# EAGLE schematic Nadajnik (EAGLE 9.0.1)
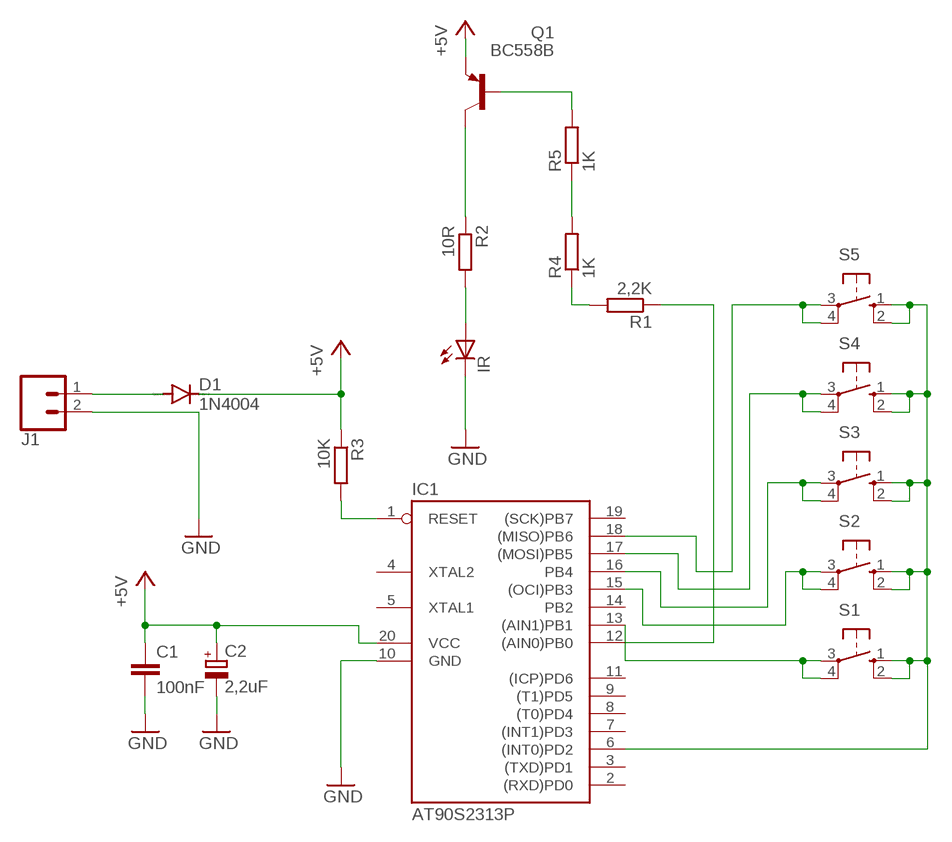
[diagram p0: schematic, sheet 1]

## Parts
C1  100nF  C-EU025-024X044  [C025-024X044]
C2  2,2uF  CPOL-EU140CLH-1010  [140CLH-1010]
D1  1N4004  [DO41-10]
IC1  AT90S2313P  [DIL20]
IR  LED5MM  [LED5MM]
J1  CONN_02  [1X02]
Q1  BC558B  [TO92-EBC]
R1  2,2K  R-EU_0207/10  [0207/10]
R2  10R  R-EU_0207/10  [0207/10]
R3  10K  R-EU_0207/10  [0207/10]
R4  1K  R-EU_0207/10  [0207/10]
R5  1K  R-EU_0207/10  [0207/10]
S1  10-XX  [B3F-10XX]
S2  10-XX  [B3F-10XX]
S3  10-XX  [B3F-10XX]
S4  10-XX  [B3F-10XX]
S5  10-XX  [B3F-10XX]

## Nets
+5V: C1.1 C2.+ D1.C IC1.20(VCC) Q1.E R3.1
GND: C1.2 C2.- IC1.10(GND) IR.K(C) J1.2
N$1: IC1.12((AIN0)PB0) S1.3(P) S1.4(P1)
N$2: IC1.15((OCI)PB3) S2.3(P) S2.4(P1)
N$3: IC1.16(PB4) S3.3(P) S3.4(P1)
N$4: IC1.17((MOSI)PB5) S4.3(P) S4.4(P1)
N$5: IC1.18((MISO)PB6) S5.3(P) S5.4(P1)
N$6: R1.2 R4.1
N$7: IC1.13((AIN1)PB1) R1.1
N$8: Q1.C R2.1
N$9: R4.2 R5.1
N$10: IR.A R2.2
N$11: IC1.6((INT0)PD2) S1.1(S) S1.2(S1) S2.1(S) S2.2(S1) S3.1(S) S3.2(S1) S4.1(S) S4.2(S1) S5.1(S) S5.2(S1)
N$13: Q1.B R5.2
N$14: D1.A J1.1
N$15: IC1.1(RESET) R3.2
Unconnected: IC1.2((RXD)PD0) IC1.3((TXD)PD1) IC1.4(XTAL2) IC1.5(XTAL1) IC1.7((INT1)PD3) IC1.8((T0)PD4) IC1.9((T1)PD5) IC1.11((ICP)PD6) IC1.14(PB2) IC1.19((SCK)PB7)

## Library data of the parts
C1 = resistor:C-EU: CAPACITOR, European symbol
C2 = resistor:CPOL-EU: POLARIZED CAPACITOR, European symbol
D1 = diode:1N4004: DIODE general purpose rectifier, 1 A
IC1 = avr-4:AT90S2313: MICROCONTROLLER 2 Kbytes FLASH 128 bytes SRAM 128 bytes EEPROM UART
IR = led:LED: LED OSRAM: - CHIPLED LG R971, LG N971, LY N971, LG Q971, LY Q971, LO R971, LY R971 LH N974, LH R974 LS Q976, LO Q976, LY Q976 LO Q996 - Hyper CHIPLED LW Q18S LB Q993, LB Q99A, LB R99A - SideLED LS A670, LO A670, LY A670, LG A670, LP A670 LB A673, LV A673, LT A673, LW A673 LH A674 LY A675 LS A676, LA A676, LO A676, LY A676, LW A676 LS A679, LY A679, LG A679 - Hyper Micro SIDELED® LS Y876, LA Y876, LO Y876, LY Y876 LT Y87S - SmartLED LW L88C, LW L88S LB L89C, LB L89S, LG L890 LS L89K, LO L89K, LY L89K LS L896, LA L896, LO L896, LY L896 - TOPLED LS T670, LO T670, LY T670, LG T670, LP T670 LSG T670, LSP T670, LSY T670, LOP T670, LYG T670 LG T671, LOG T671, LSG T671 LB T673, LV T673, LT T673, LW T673 LH T674 LS T676, LA T676, LO T676, LY T676, LB T676, LH T676, LSB T676, LW T676 LB T67C, LV T67C, LT T67C, LS T67K, LO T67K, LY T67K, LW E67C LS E67B, LA E67B, LO E67B, LY E67B, LB E67C, LV E67C, LT E67C LW T67C LS T679, LY T679, LG T679 LS T770, LO T770, LY T770, LG T770, LP T770 LB T773, LV T773, LT T773, LW T773 LH T774 LS E675, LA E675, LY E675, LS T675 LS T776, LA T776, LO T776, LY T776, LB T776 LHGB T686 LT T68C, LB T68C - Hyper Mini TOPLED® LB M676 - Mini TOPLED Santana® LG M470 LS M47K, LO M47K, LY M47K Source: http://www.osram.convergy.de LUXEON: - LUMILED® LXK2-PW12-R00, LXK2-PW12-S00, LXK2-PW14-U00, LXK2-PW14-V00 LXK2-PM12-R00, LXK2-PM12-S00, LXK2-PM14-U00 LXK2-PE12-Q00, LXK2-PE12-R00, LXK2-PE12-S00, LXK2-PE14-T00, LXK2-PE14-U00 LXK2-PB12-K00, LXK2-PB12-L00, LXK2-PB12-M00, LXK2-PB14-N00, LXK2-PB14-P00, LXK2-PB14-Q00 LXK2-PR12-L00, LXK2-PR12-M00, LXK2-PR14-Q00, LXK2-PR14-R00 LXK2-PD12-Q00, LXK2-PD12-R00, LXK2-PD12-S00 LXK2-PH12-R00, LXK2-PH12-S00 LXK2-PL12-P00, LXK2-PL12-Q00, LXK2-PL12-R00 Source: www.luxeon.com KINGBRIGHT: KA-3528ASYC Source: www.kingbright.com
J1 = SparkFun-Connectors:CONN_02: Multi connection point. Often used as Generic Header-pin footprint for 0.1 inch spaced/style header connections On any of the 0.1 inch spaced packages, you can populate with these: Break Away Headers - Straight <https://www.sparkfun.com/products/116> (PRT-00116) Break Away Male Headers - Right Angle <https://www.sparkfun.com/products/553> (PRT-00553) Female Headers <https://www.sparkfun.com/products/115> (PRT-00115) Break Away Headers - Machine Pin <https://www.sparkfun.com/products/117> (PRT-00117) Break Away Female Headers - Swiss Machine Pin <https://www.sparkfun.com/products/743> (PRT-00743) For SCREWTERMINALS and SPRING TERMINALS visit here: Screw Terimnals on SparkFun.com <https://www.sparkfun.com/search/results?term=Screw+Terminals> (5mm/3.5mm/2.54mm spacing) This device is also useful as a general connection point to wire up your design to another part of your project. Our various solder wires solder well into these plated through hole pads. Hook-Up Wire - Assortment (Stranded, 22 AWG) <https://www.sparkfun.com/products/11375> (PRT-11375) Hook-Up Wire - Assortment (Solid Core, 22 AWG) <https://www.sparkfun.com/products/11367> (PRT-11367) View the entire wire category on our website here <https://www.sparkfun.com/categories/141> Special notes: Molex polarized connector foot print use with: PRT-08233 with associated crimp pins and housings. 2.54_SCREWTERM for use with PRT-10571. 3.5mm Screw Terminal footprints for PRT-08084 5mm Screw Terminal footprints for use with PRT-08432
Q1 = transistor-pnp:BC558*: PNP Transistror
R1-R5 = resistor:R-EU_: RESISTOR, European symbol
S1-S5 = switch-omron:10-XX: OMRON SWITCH; MPN: B3F-1000; OC_FARNELL: 176432; OC_NEWARK: 36M3542